# Altium schematic sheet Sheet1.SchDoc
size A4; SheetNumber: 1; SheetTotal: 1
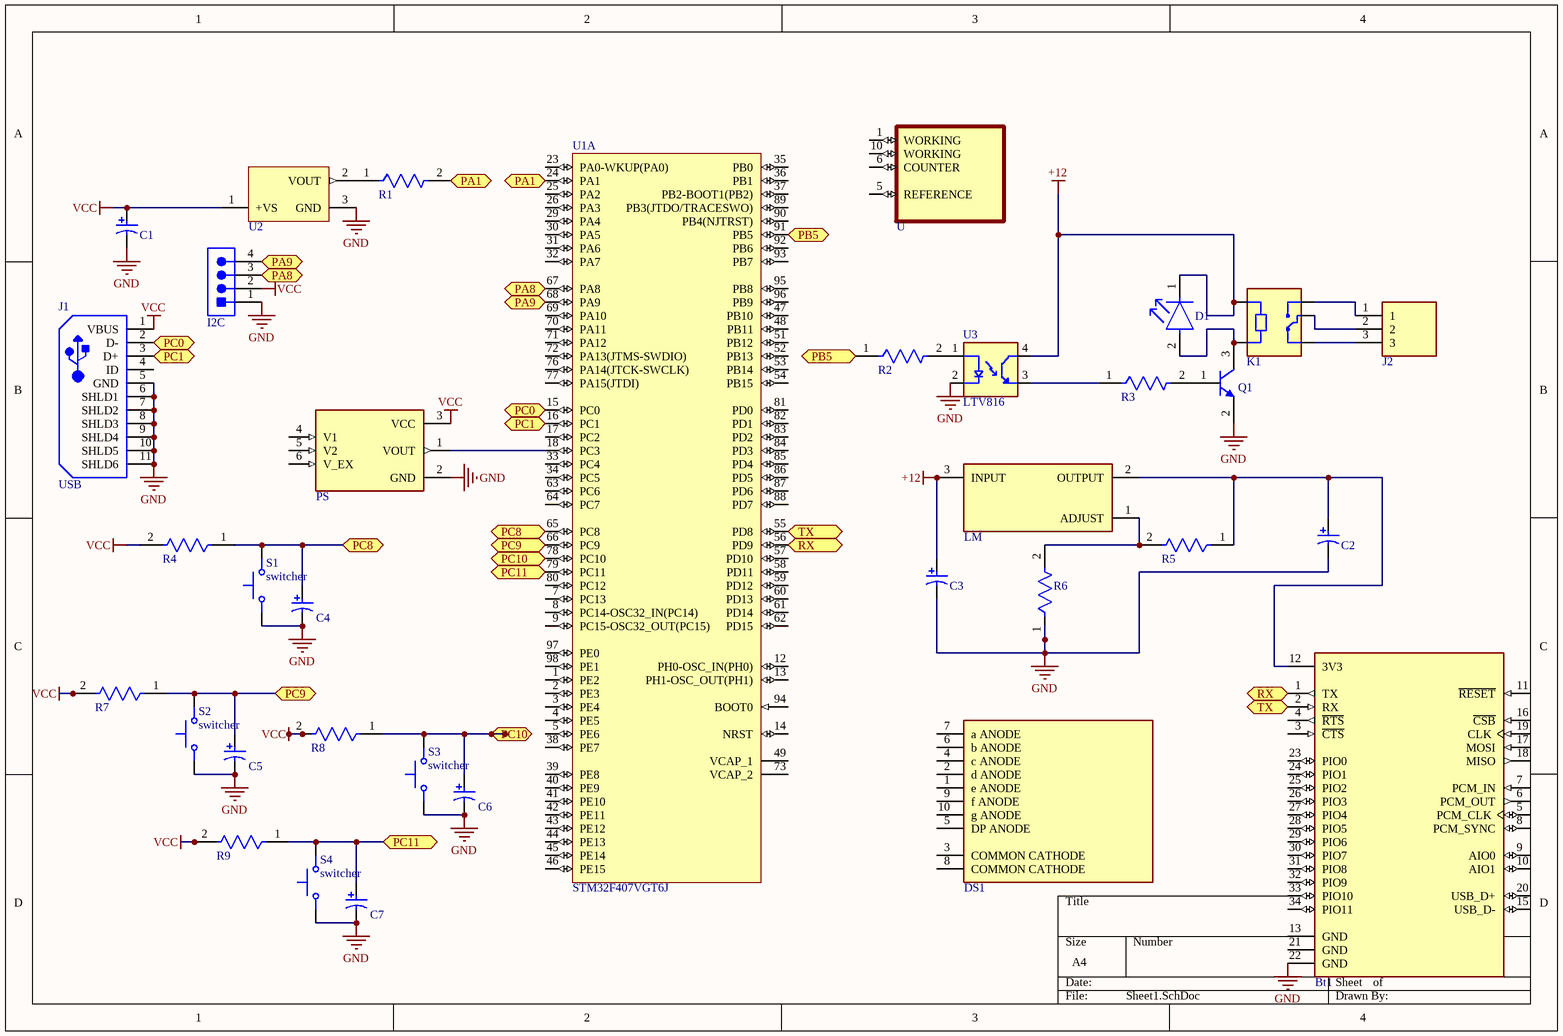
[diagram p0: Sheet1.SchDoc]

## Parts
Bt1  BLUETOOTH-HC-06  [BLUETOOTH-SERIAL-HC-06]  (value not drawn)
C1  EEE-1CA100SR  [Capacitor]  (value not drawn)
C2  EEE-1CA100SR  [Capacitor]  (value not drawn)
C3  EEE-1CA100SR  [Capacitor]  (value not drawn)
C4  EEE-1CA100SR  [Capacitor]  (value not drawn)
C5  EEE-1CA100SR  [Capacitor]  (value not drawn)
C6  EEE-1CA100SR  [Capacitor]  (value not drawn)
C7  EEE-1CA100SR  [Capacitor]  (value not drawn)
D1  HLMP-4700  [Led]  (value not drawn)
DS1  ACSC02-41SURKWA-F01  [7seg]  (value not drawn)
I2C  640456-4  [Header4]  (value not drawn)
J1  USB  [USB-MICRO-B_V]
J2  TB006  [CUI_TB006-508-03BE]  (value not drawn)
K1  Relay  [RELAY]  (value not drawn)
LM  LM317KCT  [LM317]  (value not drawn)
PS  PressionSensor  [XDCR_MPX5010DP]  (value not drawn)
Q1  MMBTA42LT1G  [Transistor]  (value not drawn)
R1  ESR03EZPJ331  [resistor]  (value not drawn)
R2  ESR03EZPJ331  [resistor]  (value not drawn)
R3  ESR03EZPJ331  [resistor]  (value not drawn)
R4  ESR03EZPJ331  [resistor]  (value not drawn)
R5  ESR03EZPJ331  [resistor]  (value not drawn)
R6  ESR03EZPJ331  [resistor]  (value not drawn)
R7  ESR03EZPJ331  [resistor]  (value not drawn)
R8  ESR03EZPJ331  [resistor]  (value not drawn)
R9  ESR03EZPJ331  [resistor]  (value not drawn)
S1  switcher  [switcher]
S2  switcher  [switcher]
S3  switcher  [switcher]
S4  switcher  [switcher]
U  MouvementSensor  [Mouvementsensor]  (value not drawn)
U1  STM32F407VGT6J  [Stm32]  (part A of 2)
U2  TMP35GT9Z  [TMP35]  (value not drawn)
U3  LTV816  [LTV]

## Ports
PA1 (bidir), PA8 (bidir), PA9 (bidir), PB5 (bidir), PC0 (bidir), PC1 (bidir), PC8 (bidir), PC9 (bidir), PC10 (bidir), PC11 (bidir), RX (bidir), TX (bidir)

## Nets
+12: C3.1 D1.1(C) K1.A1 LM.3(INPUT) U3.4(CT)
GND: Bt1.22(GND) C1.2 C2.2 C3.2 C4.2 C5.2 C6.2 C7.2 I2C.1 J1.5(GND) J1.6(SHLD1) J1.7(SHLD2) J1.8(SHLD3) J1.9(SHLD4) J1.10(SHLD5) J1.11(SHLD6) PS.2(GND) Q1.2(E) R6.1 S1.1 S2.1 S3.1 S4.1 U2.3(GND) U3.2(C)
VCC: C1.1 I2C.2 J1.1(VBUS) PS.3(VCC) R4.2 R7.2 R8.2 R9.2 U2.1(+VS)
PA1: R1.2 U1.24(PA1) ; port PA1
PA8: I2C.3 U1.67(PA8) ; port PA8
PA9: I2C.4 U1.68(PA9) ; port PA9
PB5: R2.1 U1.91(PB5) ; port PB5
PC0: J1.2(D-) U1.15(PC0) ; port PC0
PC1: J1.3(D+) U1.16(PC1) ; port PC1
PC8: C4.1 R4.1 S1.2 U1.65(PC8) ; port PC8
PC9: C5.1 R7.1 S2.2 U1.66(PC9) ; port PC9
PC10: C6.1 R8.1 S3.2 U1.78(PC10) ; port PC10
PC11: C7.1 R9.1 S4.2 U1.79(PC11) ; port PC11
RX: Bt1.1(TX) U1.56(PD9) ; port RX
TX: Bt1.2(RX) U1.55(PD8) ; port TX
NetBt1_12: Bt1.12(3V3) C2.1 LM.2(OUTPUT) R5.1
NetD1_2: D1.2(A) K1.A2 Q1.3(C)
NetJ2_1: J2.1 K1.NO
NetJ2_2: J2.2 K1.COM
NetJ2_3: J2.3 K1.NC
NetLM_1: LM.1(ADJUST) R5.2 R6.2
NetPS_1: PS.1(VOUT) U1.18(PC3)
NetQ1_1: Q1.1(B) R3.2
NetR1_1: R1.1 U2.2(VOUT)
NetR2_2: R2.2 U3.1(A)
NetR3_1: R3.1 U3.3(ET)

Not connected (* = marked no-connect by the designer): Bt1 3(~{CTS}) 4(~{RTS}) 5(PCM_CLK) 6(PCM_OUT) 7(PCM_IN) 8(PCM_SYNC) 9(AIO0) 10(AIO1) 11(~{RESET}) 13(GND) 15(USB_D-) 16(~{CSB}) 17(MOSI) 18(MISO) 19(CLK) 20(USB_D+) 21(GND) 23(PIO0) 24(PIO1) 25(PIO2) 26(PIO3) 27(PIO4) 28(PIO5) 29(PIO6) 30(PIO7) 31(PIO8) 32(PIO9) 33(PIO10) 34(PIO11); DS1 1(e_ANODE) 2(d_ANODE) 3(COMMON_CATHODE) 4(c_ANODE) 5(DP_ANODE) 6(b_ANODE) 7(a_ANODE) 8(COMMON_CATHODE) 9(f_ANODE) 10(g_ANODE); J1 4(ID); PS 4(V1) 5(V2) 6(V_EX); U 1(WORKING) 5(REFERENCE) 6(COUNTER) 10(WORKING); U1 1(PE2) 2(PE3) 3(PE4) 4(PE5) 5(PE6) 7(PC13) 8(PC14-OSC32_IN(PC14)) 9(PC15-OSC32_OUT(PC15)) 12(PH0-OSC_IN(PH0)) 13(PH1-OSC_OUT(PH1)) 14(NRST) 17(PC2) 23(PA0-WKUP(PA0)) 25(PA2) 26(PA3) 29(PA4) 30(PA5) 31(PA6) 32(PA7) 33(PC4) 34(PC5) 35(PB0) 36(PB1) 37(PB2-BOOT1(PB2)) 38(PE7) 39(PE8) 40(PE9) 41(PE10) 42(PE11) 43(PE12) 44(PE13) 45(PE14) 46(PE15) 47(PB10) 48(PB11) 49(VCAP_1) 51(PB12) 52(PB13) 53(PB14) 54(PB15) 57(PD10) 58(PD11) 59(PD12) 60(PD13) 61(PD14) 62(PD15) 63(PC6) 64(PC7) 69(PA10) 70(PA11) 71(PA12) 72(PA13(JTMS-SWDIO)) 73(VCAP_2) 76(PA14(JTCK-SWCLK)) 77(PA15(JTDI)) 80(PC12) 81(PD0) 82(PD1) 83(PD2) 84(PD3) 85(PD4) 86(PD5) 87(PD6) 88(PD7) 89(PB3(JTDO/TRACESWO)) 90(PB4(NJTRST)) 92(PB6) 93(PB7) 94(BOOT0) 95(PB8) 96(PB9) 97(PE0) 98(PE1)

## Library data of the parts
Bt1 = BLUETOOTH-HC-06: Bluetooth Modules (802.15.1) BLUETOOTH-SERIAL-HC-06; MF: Olimex; Value: *; SnapEDA_Link: https://www.snapeda.com/parts/BLUETOOTH-SERIAL-HC-06/Olimex/view-part/?ref=snap; MP: BLUETOOTH-SERIAL-HC-06; Check_prices: https://www.snapeda.com/parts/BLUETOOTH-SERIAL-HC-06/Olimex/view-part/?ref=eda; Availability: Not in stock; Price: None; Package: None
C1-C7 = Capacitor: Aluminum Electrolytic Capacitor, 10 uF, +/- 20%, -40 to 85 degC, 2-Pin SMD, RoHS, Tape and Reel; Manufacturer: Panasonic; Lead Length: 1.8mm; No. of Pins: 2; Ripple Current Frequency: 120Hz; Ripple Current Temperature: 85°C; External Depth: 4.3mm; Operating Lifetime: 2000h; Power Factor: 0.16; Lead Cross-section Width: 0.65mm; Product Range: PANASONIC-SSeries; Voltage Rating V DC: 16V; Leakage Current: 3µA; Ripple Current AC: 28mA; AE Capacitor Case: RadialCan-SMD; Capacitance: 10µF; Lifetime @ Temperature: 2000hours@85°C; External Length / Height: 5.4mm; SVHC: NoSVHC(16-Dec-2013); Packaging: CutTape; Series: VS; Package Description: 2-Pin Surface Mount Device, Body 4.5 x 4.5 mm; Tolerance -: 20%; Capacitor Terminals: SMD; Lead Spacing: 1mm; Package / Case: B; Capacitance Tolerance: ±20%; Operating life Time: 2000h; Tape Width: 12mm; Power Factor Frequency: 120Hz; Voltage Rating: 16V; Diameter: 4mm; Operating Temperature Max: 85°C; Datasheet URL: https://datasheet.ciiva.com/19458/1355487-19458346.pdf; Capacitor Mounting: SMD; External Width: 4.3mm; Operating Life Temperature: 85°C; Capacitance Tolerance ±: ±20%; Package Reference: EEE1CA100SR; AC Ripple Current: 28mA; Tolerance +: 20%; Height: 5.4mm; Datasheet Version: 04/2005; Operating Temperature Min: -40°C; Capacitor Case Style: RadialCan-SMD; Mounting Technology: SurfaceMount; Operating Temperature Range: -40°Cto+85°C; Manufacturer URL: http://www.panasonic.com/; Life Time @ Temperature: 2000hours@85°C
D1 = led: LED RED DIFFUSED T-1 3/4 T/H; Manufacturer: Broadcom; Luminous Intensity: 2.3mcd; Peak Emmision Wavelength: 635nm; Forward Voltage: 1.7V; Viewing Angle: 50°; Led Orientation: Straight; Reverse Voltage: 5V; Forward Current: 2mA; Power Dissipation: 14mW; Wavelength: 626nm; Digikey Description: LED RED DIFFUSED T-1 3/4 T/H; Device Class L3: unset; Temperature Range Low: -40°C; Temperature Range High: +100°C; RoHS: TRUE; Package: HLMP-4700; Octopart: https://octopart.com/hlmp-4700-broadcom-71130526; Automotive: No; ComponentLink2URL: https://docs.broadcom.com/docs/AV02-1557EN; Colour: Red; Temperature: -40°C to +100°C; Lead Free: Yes; Category: Diode; ComponentLink2Description: Datasheet; Manufacturer Part Number: HLMP-4700; Device Class L1: Optoelectronics; Device Class L2: LEDs; Mouser Description: LED; Red; 2.3mcd; 0.24In.Dia.; T-1-3/4; 500mA; 1.7V; 635nm; 50deg; 5V; 24mW; -55degC;
DS1 = 7seg: DISPLAY 7-SEG 0.2" SGL RED 10SMD; Element Configuration: Common Cathode; Operating Supply Voltage: 1.95V; Wavelength: 630nm; Power Consumption: 75mW; Number of Characters: 1; Forward Current: 30mA; Test Current: 20mA; Luminous Intensity: 30mcd; Min Operating Temperature: -40°C; Package Quantity: 650; Height: 0.315inch; Packaging: Tape and Reel; Width: 0.272inch; Max Power Dissipation: 75mW; Color: Red; Illumination Color: Red; Lead Free: Lead Free; Case/Package: SMD/SMT; Max Operating Temperature: 85°C; Forward Voltage: 1.95V
I2C = Header: Male Header, Pitch 2.54 mm, 1 x 4 Position, Height 10.03 mm, Tail Length 3.56 mm, RoHS, Bulk; Manufacturer: TE Connectivity; Material, Housing: Polyester; Primary Type: InterconnectSystem; Mount Angle: Vertical; Color, Housing: White; Current, Rating: 5 / A; Agency Approvals: CSA,UL; Contact Termination Area Plating: Tin; Temperature, Operating: -55to+105 / degC; Standards: RoHSCompliant,ELVCompliant,UL94V-0; Number of Positions: 4; Brand/Series: MTA-100Series; Angle: Straight; Pin Spacing: 0.1 / "; Material, Contact: CopperAlloy; Connector Type: MTA-100; Special Features: Pinstrip; Mounting Hole Size: 0.04 / "; Contact Centerline Spacing: 0.100 / in.; Voltage, Rating: 250 / V; Manufacturer URL: http://www.te.com/; Length, Pin: 0.14 / "; Length, Overall: 0.4 / "; Color: White; Flammability Rating: UL94V-0; Mounting Type: PCMount; Termination: Solder; Datasheet URL: https://datasheet.ciiva.com/16286/eng-ds-82056-mta-0608-16286228.pdf; Number of Contacts: 4; Contact Shape: Square; Contact Mating Area Plating: Tin; Length, Terminal Post: 0.14 / in.; Size, Post: 0.025 / in.; Contact Plating: Tin; Type: PCBPlug; Datasheet Version: Dec-14; Number of Rows: 1
J1 = USB: Micro-USB B Receptacle, Right Angle, Bottom Mount, Surface Mount, with Solder Tabs, -30 to 85 degC, 5-Pin USB, RoHS, Tape and Reel; Manufacturer: Molex; Featured Product: Micro-USBConnectorsUSBConnectors; Other Names: WM1399DKR; Package Version: Rev. F, 12/2012; Number of Contacts: 5; Connector Type: USB-microB; Catalog Drawings: 1050170001; 3D Model: 105017-0001.stp; Mating Products: WM17145-ND-CABLEMICROUSBBTOSTDA1.0MWM17147-ND-CABLEMICROUSBBTOSTDA2.0MWM17146-ND-CABLEMICROUSBBTOSTDA1.5M; PCN Assembly/Origin: ResinSupplier21/Oct/2015; Voltage - Max: 30V; Online Catalog: Molex-MicroUSB; Manufacturer URL: http://www.molex.com/; Package Description: 5-Leads USB, Micro B, Body 7.5 x 5 mm, Pitch 0.65 mm; Datasheet URL: http://www.molex.com/elqNow/elqRedir.htm?ref=http://www.molex.com/webdocs/datasheets/pdf/en-us/1050170001_IO_CONNECTORS.pdf; Ingress Protection: -; Datasheet Version: 03/2016; Mounting Type: BoardCutout,SurfaceMount,RightAngle; Circuits: 5; Standard Package: 1; Package Reference: MICRO-B; Package URL: http://www.molex.com/pdm_docs/sd/1050170001_sd.pdf; Category: Connectors,Interconnects; Series: -; RoHS Information: 1050170001CertofCompliance; Features: Shielded,SolderRetention; Family: USB,DVI,HDMIConnectors; Specifications: -; Gender: Receptacle; Packaging: Digi-Reel®; Mounting Technology: SurfaceMount
J2 = TB006: 2~24 Poles, Screw Type, Horizontal, 5.08 Pitch, 26~14 (AWG), Terminal Block Connector; MF: CUI Devices; MP: TB006-508-03BE; Price: None; CUI_purchase_URL: https://www.cuidevices.com/product/interconnect/connectors/terminal-blocks/tb006-508-series?utm_source=snapeda.com&utm_medium=referral&utm_campaign=snapedaBOM; Purchase-URL: https://pricing.snapeda.com/search/part/TB006-508-03BE/?ref=eda; Value: *; Package: None; SnapEDA_Link: https://www.snapeda.com/parts/TB006-508-03BE/CUI+Devices/view-part/?ref=snap; Availability: In Stock; Check_prices: https://www.snapeda.com/parts/TB006-508-03BE/CUI+Devices/view-part/?ref=eda
K1 = Relay: 5V Trigger Relay Module For Arduino And Raspberry Pi 5V Trigger Relay Module For Arduino And Raspberry Pi; MF: Songle Relay; MP: SRD-05VDC-SL-C; Check_prices: https://www.snapeda.com/parts/SRD-05VDC-SL-C/Songle+Relay/view-part/?ref=eda; Value: *; Availability: Not in stock; Price: None; Package: NON STANDARD-5 Songle Relay; SnapEDA_Link: https://www.snapeda.com/parts/SRD-05VDC-SL-C/Songle+Relay/view-part/?ref=snap
LM = LM317: IC REG LIN POS ADJ 1.5A TO220-3; Power Supply Rejection Ratio (PSRR): 57dB; Output Voltage: 37V; Number of Regulators: 1; Polarity: Positive; Power Rating: 20W; Max Input Voltage: 40V; Min Input Voltage: 4.2V; Min Output Voltage: 1.25V; Quiescent Current: 3.5mA; Dropout Voltage: 2V; Output Type: Adjustable; Lead Free: Lead Free; RoHS Compliant: Yes; Number of Outputs: 1; Mount: Through Hole; Height: 16.51mm; Weight: 0.211644oz; Max Operating Temperature: 125°C; Number of Pins: 3; Max Output Voltage: 37V; Packaging: Rail/Tube; REACH SVHC: No SVHC; Width: 4.65mm; Case/Package: TO-220; Min Operating Temperature: 0°C; Length: 10.67mm; Reference Voltage: 1.25V; Series: LM317; Max Output Current: 1.5A; Output Current: 1.5A; Package Quantity: 50; Radiation Hardening: No
PS = PressionSensor: Pressure Sensor 1.45PSI _10kPa_ Differential Male - 0.19 _4.93mm_ Tube 0.2 V ~ 4.7 V 6-SIP Module; MF: NXP USA; MP: MPX5010DP; Price: None; Package: SIP-6 NXP Semiconductors; Value: *; SnapEDA_Link: https://www.snapeda.com/parts/MPX5010DP/NXP%20USA%20Inc./view-part/597709/?ref=snap; Availability: Unavailable
Q1 = Transistor: High Voltage Transistor, NPN Silicon, 3-Pin SOT-23, Pb-Free, Tape and Reel; Manufacturer: On Semiconductor; fT Min (MHz): 50; IC Continuous (A): 0.5; ComponentLink1URL: http://www.onsemi.com/; ComponentLink3URL: http://www.onsemi.cn/pub_link/Collateral/318-08.PDF; RoHS: TRUE; ComponentLink2Description: Datasheet; PartNumber: MMBTA42LT1G; Polarity: NPN; DatasheetVersion: Rev. 12; PackageReference: SOT-23-3-318-08; PackageDescription: 3-Pin Small Outline Transistor, Body 2.92 x 1.3 mm, Pitch 0.95 mm; ComponentLink3Description: Package Specification; ComponentLink1Description: Manufacturer URL; Packing: Tape and Reel; PackageVersion: Rev. AP, 11/2009; Mounting Technology: Surface Mount; ComponentLink2URL: http://www.onsemi.cn/pub_link/Collateral/MMBTA42LT1-D.PDF
R1-R9 = Resistor: 330Ω ±5% 0.25W 0603 Anti-Surge Chip Resistor AEC-Q200; Temperature Coefficient: 200ppm/°C; Resistance: 330R; Max Power Dissipation: 250mW; Case/Package: 0603; Case Code (Metric): 1608; RoHS Compliant: Yes; Max Operating Temperature: 155°C; Packaging: Tape and Reel; Features: Automotive AEC-Q200; Width: 0.8mm; Case Code (Imperial): 0603; Length: 1.6mm; Height: 0.45mm; Min Operating Temperature: -55°C; Series: ESR; Tolerance: 5%; Number of Terminations: 2
S1-S4 = switcher: SWITCH TACTILE SPST-NO 0.05A 12V; MF: E-Switch; MP: TL59NF160Q; Purchase-URL: https://pricing.snapeda.com/search/part/TL59NF160Q/?ref=eda; Package: None; Value: *; SnapEDA_Link: https://www.snapeda.com/parts/TL59NF160Q/E-Switch/view-part/?ref=snap; Check_prices: https://www.snapeda.com/parts/TL59NF160Q/E-Switch/view-part/?ref=eda; Price: None; Availability: In Stock
U = MouvementSensor: SENSOR GAS O3 SMT; MP: 110-407; MF: SPEC Sensors, LLC; Package: None; Availability: Bad; SnapEDA_Link: https://www.snapeda.com/parts/110-407/SPEC%20Sensors/view-part/4872318/?ref=snap; Price: None; Value: *; DigiKey-Purchase-URL: https://snapeda.com/shop?store=DigiKey&id=4872318
U1 = Stm: ARM Cortex-M4 32-bit MCU+FPU, 210 DMIPS, 1024 kB Flash, 192 kB Internal RAM, 82 I/Os, 100-pin LQFP, -40 to 85 degC, Tray; Manufacturer: STMicroelectronics; Internal RAM Size (kB): 192; Operating Frequency(F) (Processor speed) (MHz): 168; FLASH Size (Prog) (kB): 1024; I/Os (High Current): 82; Supply Voltage(Vcc) max (V): 3.6; D/A Converter: 2x12-bit; Supply Voltage(Vcc) min (V): 1.8; PackageReference: LQFP100; ComponentLink2URL: http://www.st.com/st-web-ui/static/active/en/resource/technical/document/datasheet/DM00037051.pdf; Packing: Tray; ComponentLink3Description: Package Specification; PackageDescription: 100-Pin Low Profile Quad Flat Package, 14 x 14 mm Body, 0.5 mm Pitch; PackageVersion: Rev. 1, 06/2013; ComponentLink1Description: Manufacturer URL; PartNumber: STM32F407VGT6J; Core: ARM Cortex-M4; ComponentLink2Description: Datasheet; ComponentLink1URL: http://www.st.com/web/en/home.html; Mounting Technology: Surface Mount; DatasheetVersion: Rev. 4; ComponentLink3URL: http://www.st.com/st-web-ui/static/active/en/resource/technical/document/data_brief/DM00071938.pdf
U2 = TMP35: Voltage Output Temperature Sensor, 2.7 to 5.5 V Supply, Industrial, 3-pin TO92 (T-3), Tray; Manufacturer: Analog Devices; ComponentLink3Description: Package Specification; Code_JEDEC: TO-226-AA; Supply Voltage Range: 2.7 to 5.5 V; ComponentLink1Description: Manufacturer URL; Packing: Tray; PackageDescription: 3-Pin Plastic Header-Style Package, 1.27 mm Pitch; ComponentLink4Description: Product URL; Mounting Technology: Through Hole; PackageVersion: 042208-A, 04/2008; ComponentLink2Description: Datasheet; PackageReference: T-3; ComponentLink1URL: http://www.analog.com/en/index.html; ComponentLink2URL: http://www.analog.com/static/imported-files/data_sheets/TMP35_36_37.pdf; ComponentLink3URL: http://www.analog.com/static/imported-files/packages/PKG_PDF/TO-92(T)/T_3.pdf; PartNumber: TMP35GT9Z; DatasheetVersion: Rev. F; ComponentLink4URL: http://www.analog.com/en/mems-sensors/digital-temperature-sensors/tmp35/products/product.html
U3 = LTV816: Optoisolator Transistor Output 5000Vrms 1 Channel 4-DIP; MF: Lite-On Inc.; SnapEDA_Link: https://www.snapeda.com/parts/LTV816/Lite-On+Inc./view-part/?ref=snap; Availability: In Stock; Price: None; Purchase-URL: https://pricing.snapeda.com/search/part/LTV816/?ref=eda; Check_prices: https://www.snapeda.com/parts/LTV816/Lite-On+Inc./view-part/?ref=eda; Package: PDIP-4 Lite-On; MP: LTV816; Value: *